# EAGLE schematic 20200413_Systems_EA_00 (EAGLE 9.5.1)
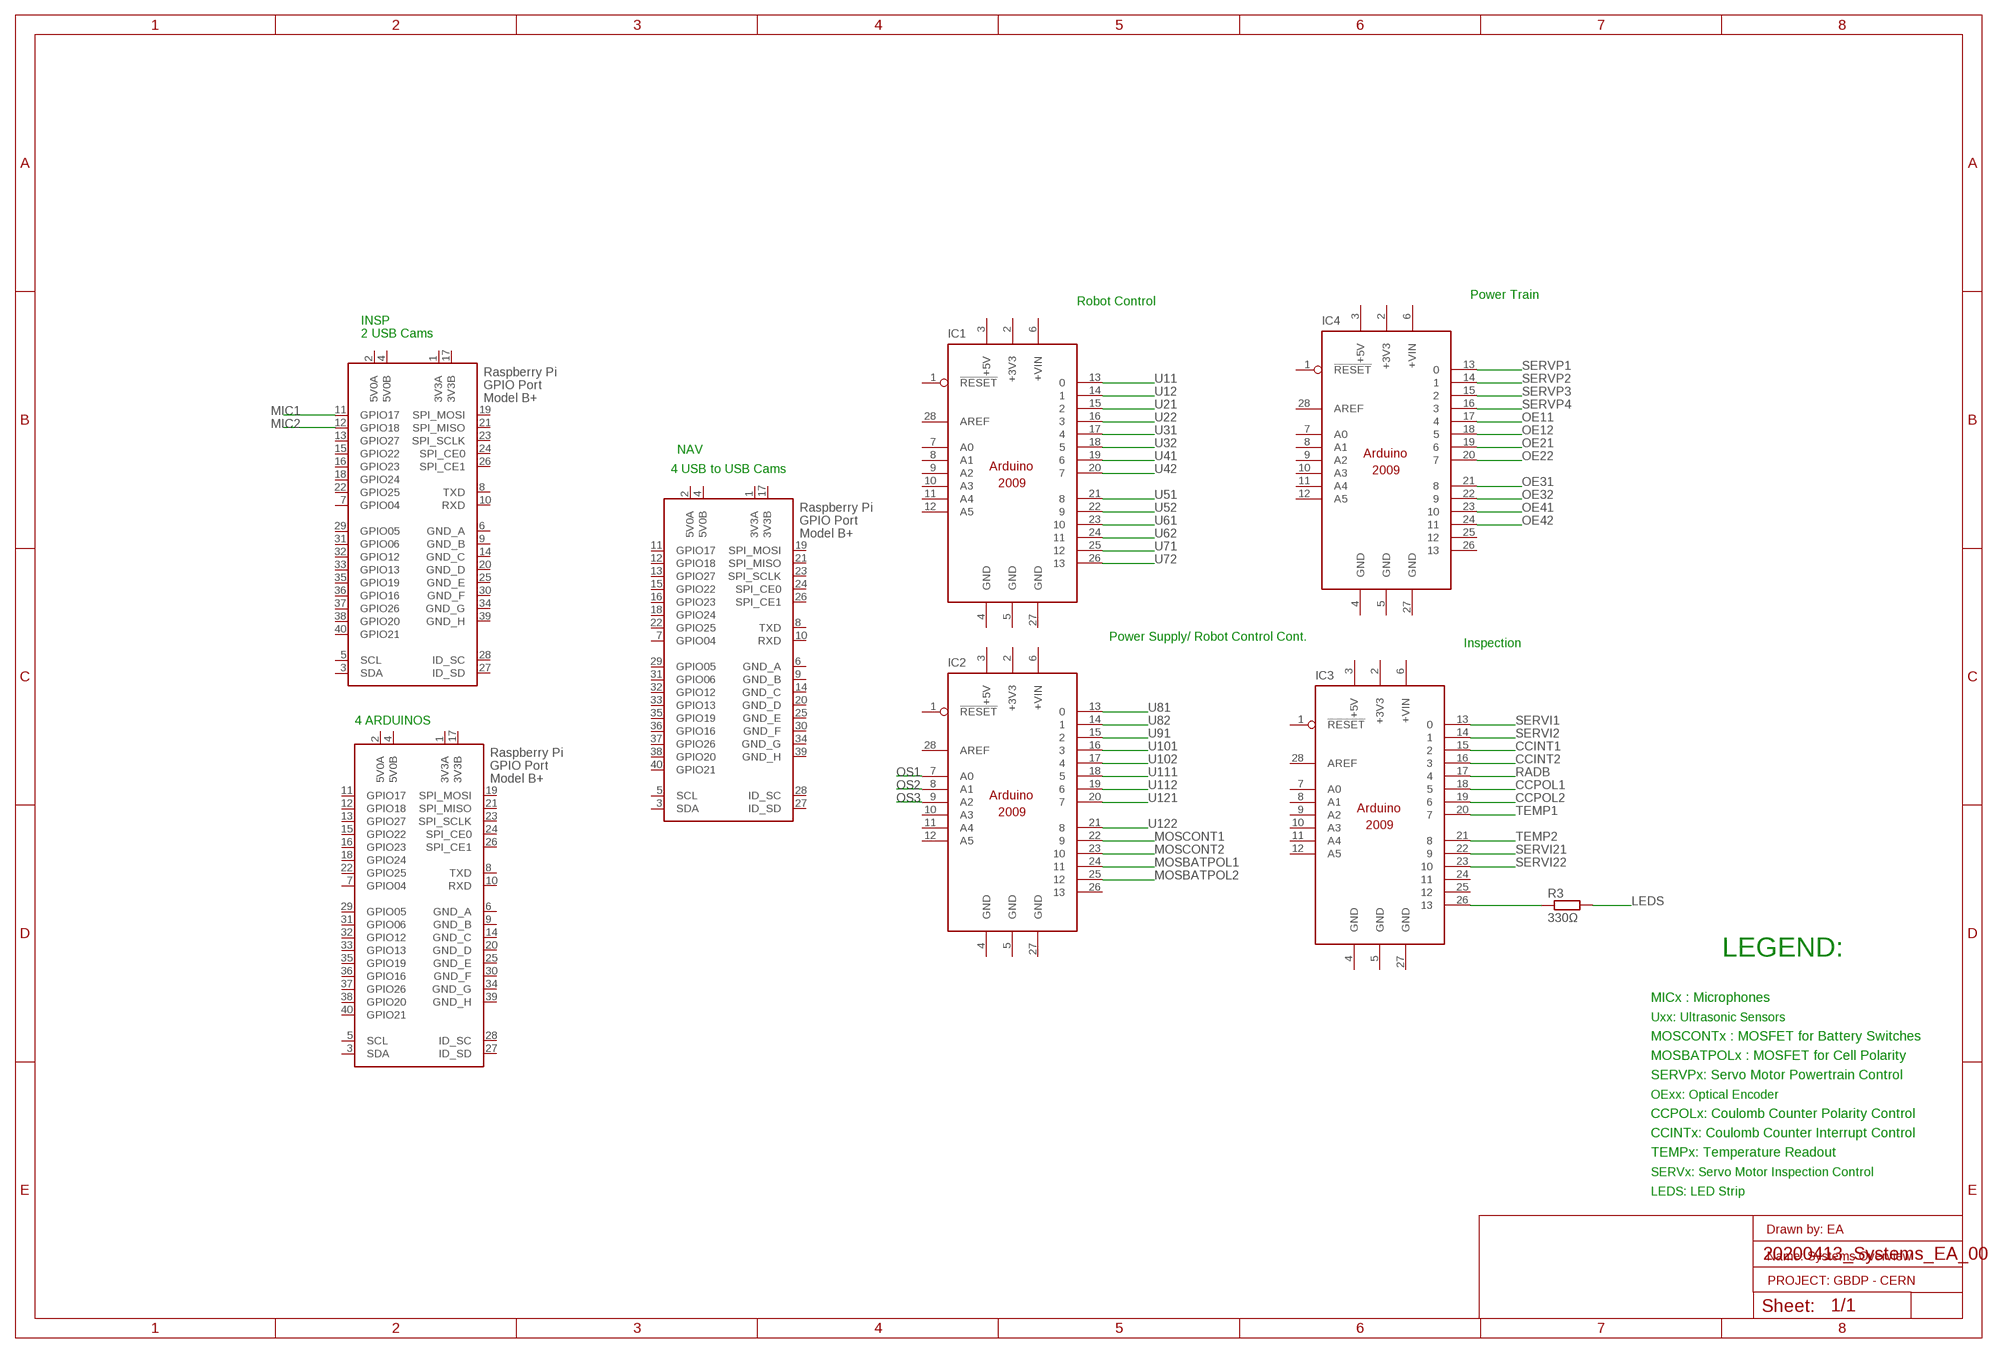
[diagram p0: schematic, sheet 1]

## Parts
IC1  ARDUINO2009_10  [ARDUINO2009]
IC2  ARDUINO2009_10  [ARDUINO2009]
IC3  ARDUINO2009_10  [ARDUINO2009]
IC4  ARDUINO2009_10  [ARDUINO2009]
R3  330Ω  R-EU_0204/7  [0204/7]
X1  RASPI_BOARD_B+#_FP  [RASPI_BOARD_B+_FULL_PAD]
X2  RASPI_BOARD_B+#_FP  [RASPI_BOARD_B+_FULL_PAD]
X3  RASPI_BOARD_B+#_FP  [RASPI_BOARD_B+_FULL_PAD]

## Nets
CCINT1: IC3.15
CCINT2: IC3.16
CCPOL1: IC3.18
CCPOL2: IC3.19
LEDS: R3.2
MIC1: X2.11(GPIO17)
MIC2: X2.12(GPIO18)
MOSBATPOL1: IC2.24
MOSBATPOL2: IC2.25
MOSCONT1: IC2.22
MOSCONT2: IC2.23
N$2: IC3.26 R3.1
OE11: IC4.17
OE12: IC4.18
OE21: IC4.19
OE22: IC4.20
OE31: IC4.21
OE32: IC4.22
OE41: IC4.23
OE42: IC4.24
OS1: IC2.7(A0)
OS2: IC2.8(A1)
OS3: IC2.9(A2)
RADB: IC3.17
SERVI1: IC3.13
SERVI2: IC3.14
SERVI21: IC3.22
SERVI22: IC3.23
SERVP1: IC4.13
SERVP2: IC4.14
SERVP3: IC4.15
SERVP4: IC4.16
TEMP1: IC3.20
TEMP2: IC3.21
U11: IC1.13
U12: IC1.14
U21: IC1.15
U22: IC1.16
U31: IC1.17
U32: IC1.18
U41: IC1.19
U42: IC1.20
U51: IC1.21
U52: IC1.22
U61: IC1.23
U62: IC1.24
U71: IC1.25
U72: IC1.26
U81: IC2.13
U82: IC2.14
U91: IC2.15
U101: IC2.16
U102: IC2.17
U111: IC2.18
U112: IC2.19
U121: IC2.20
U122: IC2.21
Unconnected: IC1.1(!RESET) IC1.6(+VIN) IC1.7(A0) IC1.8(A1) IC1.9(A2) IC1.10(A3) IC1.11(A4) IC1.12(A5) IC1.28(AREF) IC2.1(!RESET) IC2.6(+VIN) IC2.10(A3) IC2.11(A4) IC2.12(A5) IC2.26 IC2.28(AREF) IC3.1(!RESET) IC3.6(+VIN) IC3.7(A0) IC3.8(A1) IC3.9(A2) IC3.10(A3) IC3.11(A4) IC3.12(A5) IC3.24 IC3.25 IC3.28(AREF) IC4.1(!RESET) IC4.6(+VIN) IC4.7(A0) IC4.8(A1) IC4.9(A2) IC4.10(A3) IC4.11(A4) IC4.12(A5) IC4.25 IC4.26 IC4.28(AREF) X1.3(SDA) X1.5(SCL) X1.7(GPIO04) X1.8(TXD) X1.10(RXD) X1.11(GPIO17) X1.12(GPIO18) X1.13(GPIO27) X1.15(GPIO22) X1.16(GPIO23) X1.18(GPIO24) X1.19(SPI_MOSI) X1.21(SPI_MISO) X1.22(GPIO25) X1.23(SPI_SCLK) X1.24(SPI_CE0) X1.26(SPI_CE1) X1.27(ID_SD) X1.28(ID_SC) X1.29(GPIO05) X1.31(GPIO06) X1.32(GPIO12) X1.33(GPIO13) X1.35(GPIO19) X1.36(GPIO16) X1.37(GPIO26) X1.38(GPIO20) X1.40(GPIO21) X2.3(SDA) X2.5(SCL) X2.7(GPIO04) X2.8(TXD) X2.10(RXD) X2.13(GPIO27) X2.15(GPIO22) X2.16(GPIO23) X2.18(GPIO24) X2.19(SPI_MOSI) X2.21(SPI_MISO) X2.22(GPIO25) X2.23(SPI_SCLK) X2.24(SPI_CE0) X2.26(SPI_CE1) X2.27(ID_SD) X2.28(ID_SC) X2.29(GPIO05) X2.31(GPIO06) X2.32(GPIO12) X2.33(GPIO13) X2.35(GPIO19) X2.36(GPIO16) X2.37(GPIO26) X2.38(GPIO20) X2.40(GPIO21) X3.3(SDA) X3.5(SCL) X3.7(GPIO04) X3.8(TXD) X3.10(RXD) X3.11(GPIO17) X3.12(GPIO18) X3.13(GPIO27) X3.15(GPIO22) X3.16(GPIO23) X3.18(GPIO24) X3.19(SPI_MOSI) X3.21(SPI_MISO) X3.22(GPIO25) X3.23(SPI_SCLK) X3.24(SPI_CE0) X3.26(SPI_CE1) X3.27(ID_SD) X3.28(ID_SC) X3.29(GPIO05) X3.31(GPIO06) X3.32(GPIO12) X3.33(GPIO13) X3.35(GPIO19) X3.36(GPIO16) X3.37(GPIO26) X3.38(GPIO20) X3.40(GPIO21)

## Notes on the sheet
- Power Train
- Robot Control
- INSP
- 2 USB Cams
- NAV
- 4 USB to USB Cams
- Power Supply/ Robot Control Cont.
- Inspection
- 4 ARDUINOS
- LEGEND:
- MICx : Microphones
- Uxx: Ultrasonic Sensors
- MOSCONTx : MOSFET for Battery Switches
- MOSBATPOLx : MOSFET for Cell Polarity
- SERVPx: Servo Motor Powertrain Control
- OExx: Optical Encoder
- CCPOLx: Coulomb Counter Polarity Control
- CCINTx: Coulomb Counter Interrupt Control
- TEMPx: Temperature Readout
- SERVx: Servo Motor Inspection Control
- LEDS: LED Strip
- Drawn by: EA
- Name: Systems Overview
- PROJECT: GBDP - CERN

## Power pins joined to a net without a drawn wire
3V3A: X1.1(3V3A) X2.1(3V3A) X3.1(3V3A)
3V3B: X1.17(3V3B) X2.17(3V3B) X3.17(3V3B)
5V0A: X1.2(5V0A) X2.2(5V0A) X3.2(5V0A)
5V0B: X1.4(5V0B) X2.4(5V0B) X3.4(5V0B)
+3V3: IC1.2(+3V3) IC2.2(+3V3) IC3.2(+3V3) IC4.2(+3V3)
+5V: IC1.3(+5V) IC2.3(+5V) IC3.3(+5V) IC4.3(+5V)
GND: IC1.4(GND) IC1.5(GND) IC1.27(GND) IC2.4(GND) IC2.5(GND) IC2.27(GND) IC3.4(GND) IC3.5(GND) IC3.27(GND) IC4.4(GND) IC4.5(GND) IC4.27(GND)
GND_A: X1.6(GND_A) X2.6(GND_A) X3.6(GND_A)
GND_B: X1.9(GND_B) X2.9(GND_B) X3.9(GND_B)
GND_C: X1.14(GND_C) X2.14(GND_C) X3.14(GND_C)
GND_D: X1.20(GND_D) X2.20(GND_D) X3.20(GND_D)
GND_E: X1.25(GND_E) X2.25(GND_E) X3.25(GND_E)
GND_F: X1.30(GND_F) X2.30(GND_F) X3.30(GND_F)
GND_G: X1.34(GND_G) X2.34(GND_G) X3.34(GND_G)
GND_H: X1.39(GND_H) X2.39(GND_H) X3.39(GND_H)

## Library data of the parts
IC1-IC4 = arduino:ARDUINO2009_1: The Arduino Duemilanove ("2009") is a microcontroller board based on the ATmega168 or ATmega328. - 14 digital input/output pins (of which 6 can be used as PWM outputs) - 6 analog inputs, a 16 MHz crystal oscillator - USB connection - power jack - ISP header - reset button It contains everything needed to support the microcontroller; simply connect it to a computer with a USB cable or power it with a AC-to-DC adapter or battery to get started http://arduino.cc/en/Main/ArduinoBoardDuemilanove
R3 = rcl:R-EU_: RESISTOR, European symbol; SPICEPREFIX: R
X1-X3 = raspberrypi_bastelstube_v13_edited:RASPI_BOARD_B+#: Raspberry Pi GPIO connector with markings for the outer dimensions of the Raspberry Pi board model B+ with different sets of drill holes or mounting pads All pins connected